# Altium schematic sheet 04.SchDoc
size 420 x 297 mm
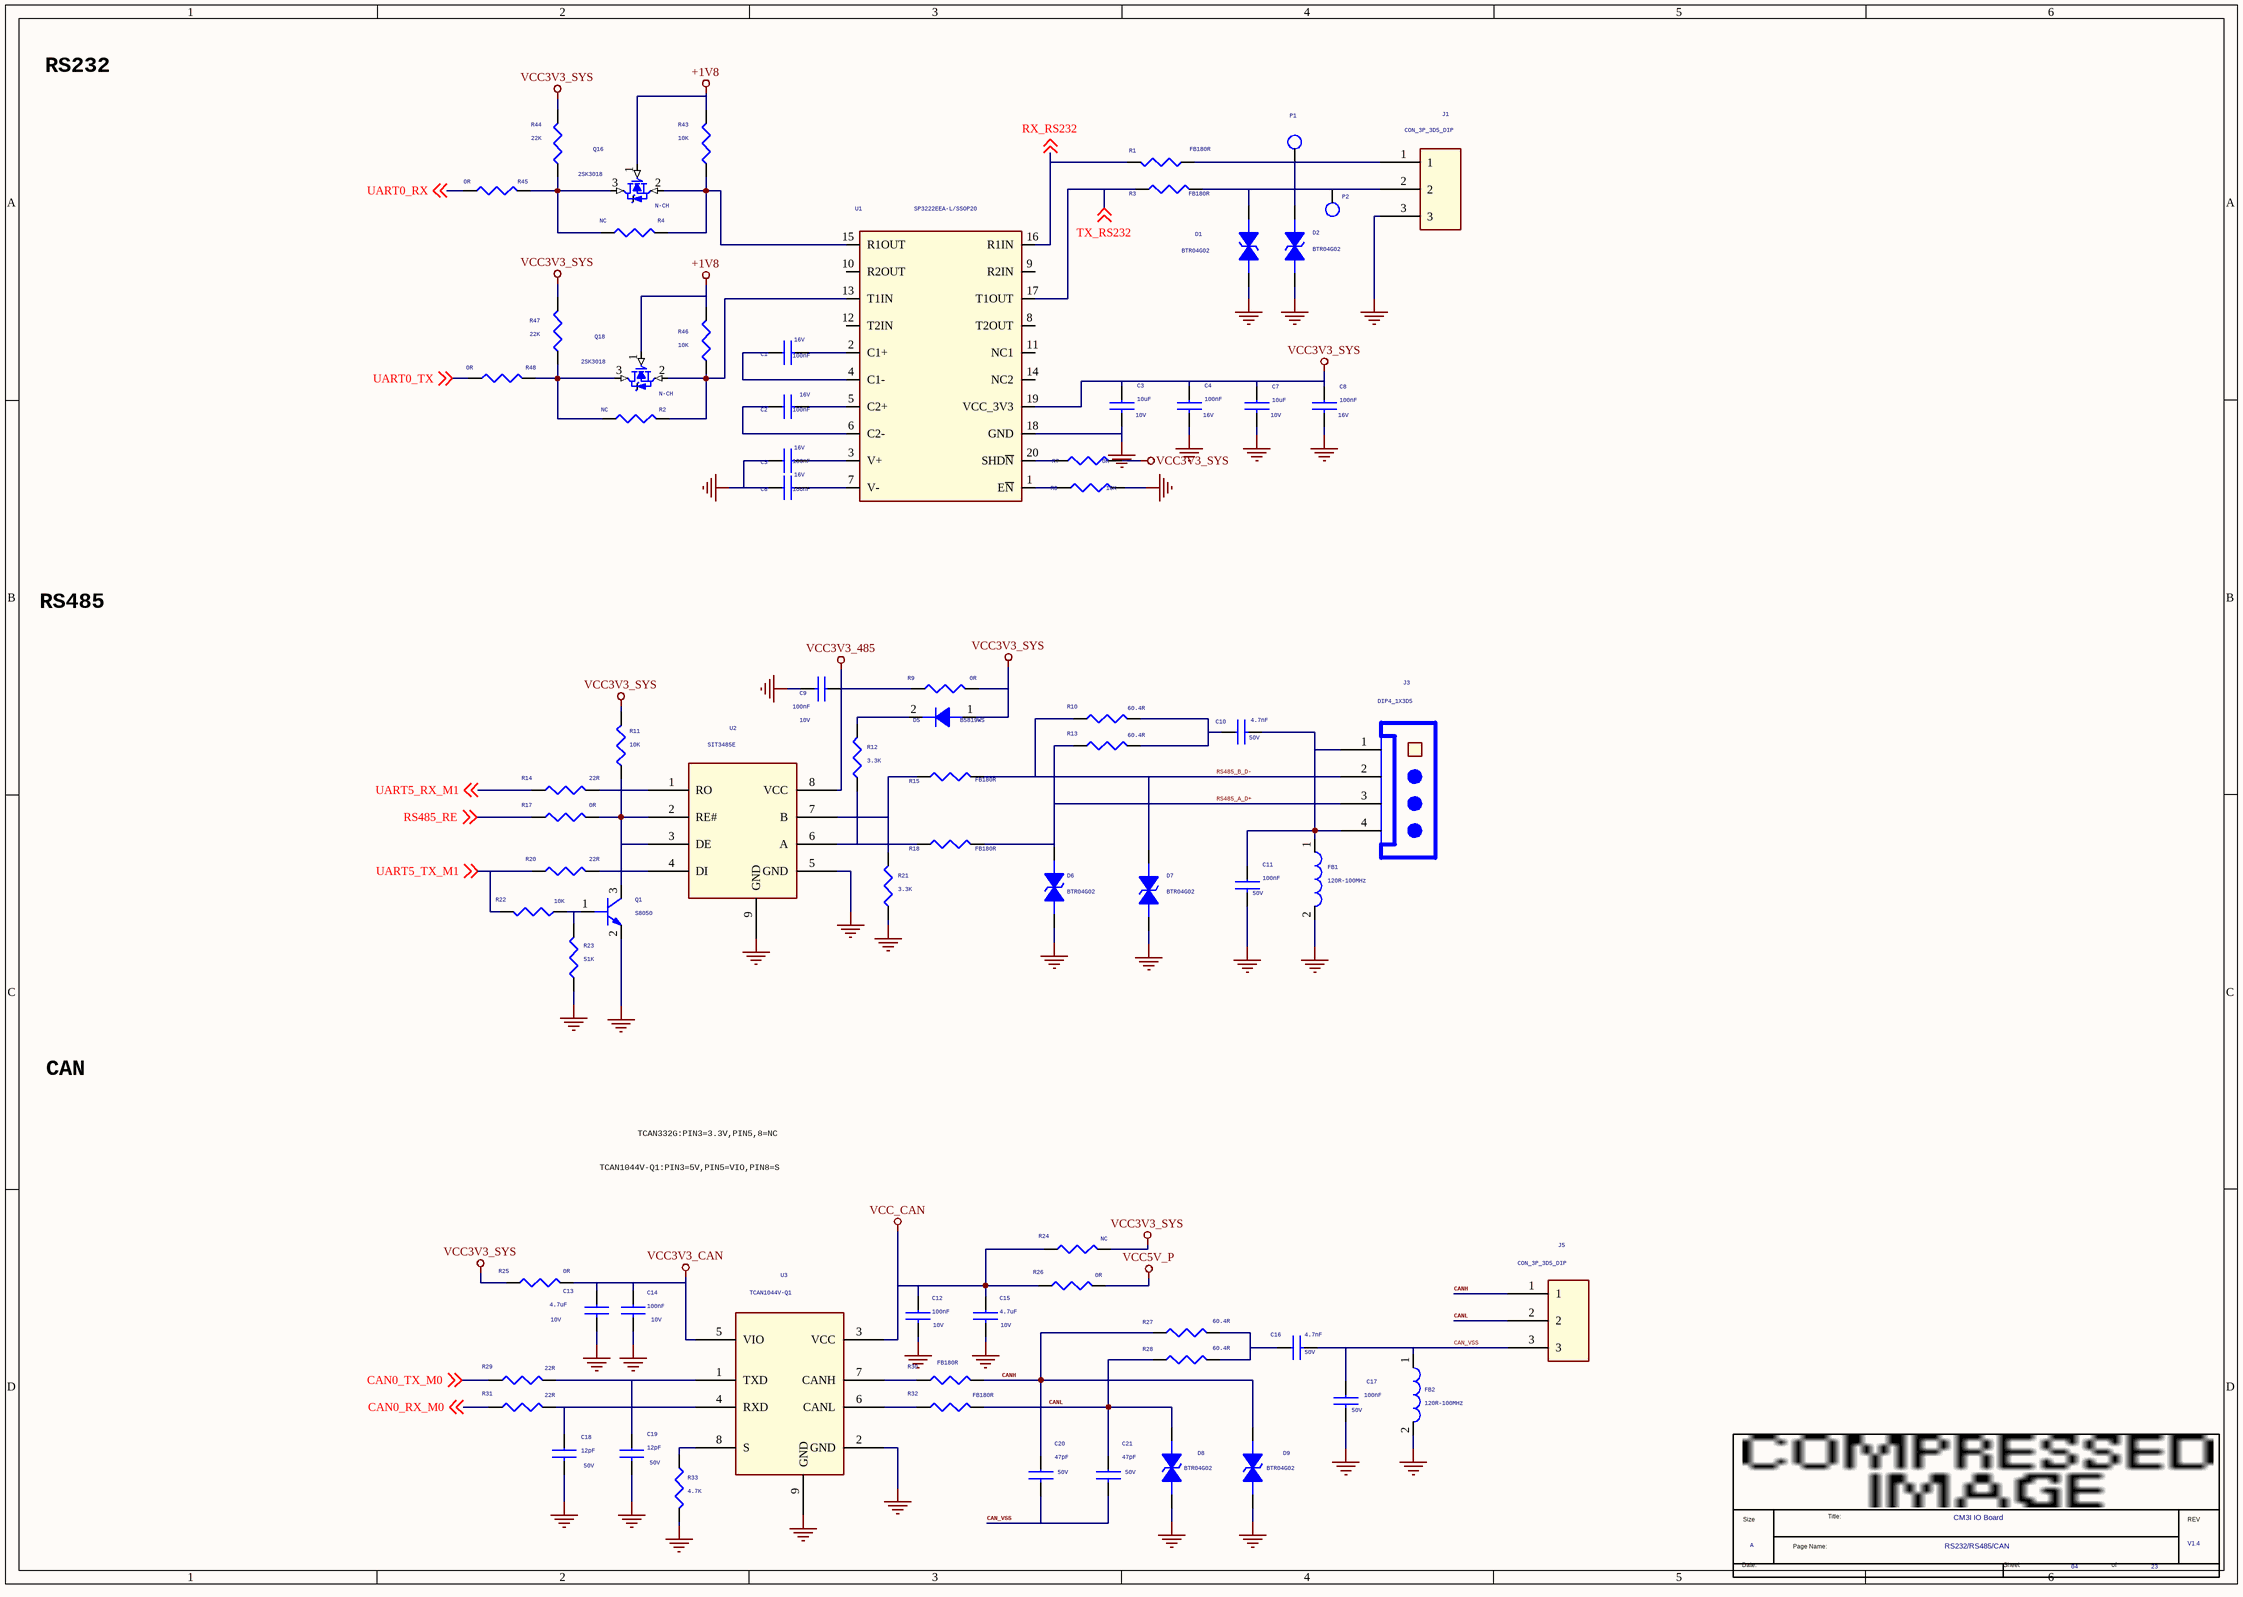
[diagram p0: 04.SchDoc]

## Parts
*  Page Count: 23  Page Number: 04  Page Size: A  Title: CM3I IO Board  RevCode: V1.4  Doc: RS232/RS485/CAN  (hidden comment: radxa_1010)  (graphical)
C1  100nF  Voltage: 16V  [C0402]
C2  100nF  Voltage: 16V  [C0402]
C3  10uF  Voltage: 10V  [C0603]
C4  100nF  Voltage: 16V  [C0402]
C5  100nF  Voltage: 16V  [C0402]
C6  100nF  Voltage: 16V  [C0402]
C7  10uF  Voltage: 10V  [C0603]
C8  100nF  Voltage: 16V  [C0402]
C9  100nF  Voltage: 10V  [C0402]
C10  4.7nF  Voltage: 50V  [C0402]
C11  100nF  Voltage: 50V  [C0603]
C12  100nF  Voltage: 10V  [C0402]
C13  4.7uF  Voltage: 10V  [C0603]
C14  100nF  Voltage: 10V  [C0402]
C15  4.7uF  Voltage: 10V  [C0603]
C16  4.7nF  Voltage: 50V  [C0402]
C17  100nF  Voltage: 50V  [C0603]
C18  12pF  Voltage: 50V  [C0402]
C19  12pF  Voltage: 50V  [C0402]
C20  47pF  Voltage: 50V  [C0402]
C21  47pF  Voltage: 50V  [C0402]
D1  BTR04G02  [ESD0402_1xD5]
D2  BTR04G02  [ESD0402_1xD5]
D5  B5819WS  [SOD_323]
D6  BTR04G02  [ESD0402_1xD5]
D7  BTR04G02  [ESD0402_1xD5]
D8  BTR04G02  [ESD0402_1xD5]
D9  BTR04G02  [ESD0402_1xD5]
FB1  120R-100MHz  [L0603]
FB2  120R-100MHz  [L0603]
J1  CON_3P_3D5_DIP  [DIP3_1X3_2R54]
J3  DIP4_1X3D5  [DIP4_1X3D5]
J5  CON_3P_3D5_DIP  [DIP3_1X3_2R54]
P1  TEST  [TEST]  (value not drawn)
P2  TEST  [TEST]  (value not drawn)
Q1  S8050  [SOT_23]
Q16  2SK3018  [S0T-23]
Q18  2SK3018  [S0T-23]
R1  FB180R  [R0402]
R2  NC  [R0402]
R3  FB180R  [R0402]
R4  NC  [R0402]
R7  0R  [R0402]
R8  10K  [R0402]
R9  0R  [R0402]
R10  60.4R  [R0402]
R11  10K  [R0402]
R12  3.3K  [R0402]
R13  60.4R  [R0402]
R14  22R  [R0402]
R15  FB180R  [R0402]
R17  0R  [R0402]
R18  FB180R  [R0402]
R20  22R  [R0402]
R21  3.3K  [R0402]
R22  10K  [R0402]
R23  51K  [R0402]
R24  NC  [R0402]
R25  0R  [R0402]
R26  0R  [R0402]
R27  60.4R  [R0402]
R28  60.4R  [R0402]
R29  22R  [R0402]
R30  FB180R  [R0402]
R31  22R  [R0402]
R32  FB180R  [R0402]
R33  4.7K  [R0402]
R43  10K  [R0402]
R44  22K  [R0402]
R45  0R  [R0402]
R46  10K  [R0402]
R47  22K  [R0402]
R48  0R  [R0402]
U1  SP3222EEA-L/SSOP20  [SSOP20_1]
U2  SIT3485E  [SOP8_5R00X4R00X1R75_T]
U3  TCAN1044V-Q1  [SOP8_5R00X4R00X1R75_T]

## Nets
+1V8: Q16.1(G) Q18.1(G) R43.1 R46.1
GND: C3.2 C4.2 C5.1 C6.1 C7.2 C8.2 C9.2 C11.2 C12.2 C13.2 C14.2 C15.2 C17.2 C18.2 C19.2 D1.1 D2.1 D6.1 D7.1 D8.1 D9.1 FB1.2 FB2.2 J1.3 Q1.2(EMITTER) R8.2 R21.2 R23.2 R33.2 U1.18(GND) U2.5(GND) U2.9(GND) U3.2(GND) U3.9(GND)
VCC3V3_485: C9.1 R9.1 U2.8(VCC)
VCC3V3_CAN: C13.1 C14.1 R25.2 U3.5(VIO)
VCC3V3_SYS: C3.1 C4.1 C7.1 C8.1 D5.1(A) R7.1 R9.2 R11.1 R24.2 R25.1 R44.1 R47.1 U1.19(VCC_3V3)
VCC5V_P: R26.2
VCC_CAN: C12.1 C15.1 R24.1 R26.1 U3.3(VCC)
CAN0_RX_M0: R31.1 ; off-sheet CAN0_RX_M0
CAN0_TX_M0: R29.1 ; off-sheet CAN0_TX_M0
CAN_VSS: C16.2 C17.1 C20.2 C21.2 FB2.1 J5.3
CANH: C20.1 D9.2 J5.1 R27.1 R30.2
CANL: C21.1 D8.2 J5.2 R28.1 R32.2
RS485_A_D+: D6.2 J3.3(TX) R13.1 R18.2
RS485_B_D-: D7.2 J3.2(RX) R10.1 R15.2
RS485_RE: R17.1 ; off-sheet RS485_RE
RX_RS232: R1.2 U1.16(R1IN) ; off-sheet RX_RS232
TX_RS232: R3.2 U1.17(T1OUT) ; off-sheet TX_RS232
UART0_RX: R45.2 ; off-sheet UART0_RX
UART0_TX: R48.2 ; off-sheet UART0_TX
UART5_RX_M1: R14.1 ; off-sheet UART5_RX_M1
UART5_TX_M1: R20.1 R22.1 ; off-sheet UART5_TX_M1
NetC1_1: C1.1 U1.4(C1-)
NetC1_2: C1.2 U1.2(C1+)
NetC2_1: C2.1 U1.6(C2-)
NetC2_2: C2.2 U1.5(C2+)
NetC5_2: C5.2 U1.3(V+)
NetC6_2: C6.2 U1.7(V-)
NetC10_1: C10.1 R10.2 R13.2
NetC10_2: C10.2 C11.1 FB1.1 J3.1(GND) J3.4(3V3)
NetC16_1: C16.1 R27.2 R28.2
NetC18_1: C18.1 R31.2 U3.4(RXD)
NetC19_1: C19.1 R29.2 U3.1(TXD)
NetD1_2: D1.2 J1.2 P2.1 R3.1
NetD2_2: D2.2 J1.1 P1.1 R1.1
NetD5_2: D5.2(K) R12.1
NetQ1_1: Q1.1(BASE) R22.2 R23.1
NetQ1_3: Q1.3(COLLECTOR) R11.2 R17.2 U2.2(RE#) U2.3(DE)
NetQ16_2: Q16.2(S) R4.1 R43.2 U1.15(R1OUT)
NetQ16_3: Q16.3(D) R4.2 R44.2 R45.1
NetQ18_2: Q18.2(S) R2.1 R46.2 U1.13(T1IN)
NetQ18_3: Q18.3(D) R2.2 R47.2 R48.1
NetR7_2: R7.2 U1.20(SHD~{N})
NetR8_1: R8.1 U1.1(E~{N})
NetR12_2: R12.2 R18.1 U2.6(A)
NetR14_2: R14.2 U2.1(RO)
NetR15_1: R15.1 R21.1 U2.7(B)
NetR20_2: R20.2 U2.4(DI)
NetR30_1: R30.1 U3.7(CANH)
NetR32_1: R32.1 U3.6(CANL)
NetR33_1: R33.1 U3.8(S)

Not connected (* = marked no-connect by the designer): U1 8(T2OUT) 9(R2IN) 10(R2OUT) 11(NC1) 12(T2IN) 14(NC2)

## Notes on the sheet
- RS232
- RS485
- CAN
- TCAN332G:PIN3=3.3V,PIN5,8=NC
- TCAN1044V-Q1:PIN3=5V,PIN5=VIO,PIN8=S
- (in symbol N-MOSFET) N-CH
- (in symbol radxa_1010) Size; Title:; REV; Page Name:; Date:; Sheet; of

## Library data of the parts
C1 C2 = CAP NP_0: cap,100.00nF,+/-10%,16V,X5R,C0402; Manufacturer: TDK; RK PN: C1005X5R1C104K050BA; Priority: A; Tolerance: 10%; Dielectric: X5R; Part Type: C0402; Manufacturer PN: C1005X5R1C104K050BA; Created by: JJJ
C3 C15 = CAP NP_0: cap,4.70uF,+/-10%,10V,X5R,C0603; Manufacturer: TDK; RK PN: C1608X5R1A475K080AC; Priority: A; Tolerance: 10%; Dielectric: X5R; Part Type: C0603; Manufacturer PN: C1608X5R1A475K080AC; Created by: JJJ
C4-C6 C8 = CAP NP_0: cap,100.00nF,+/-10%,16V,X5R,C0402; Manufacturer PN: C1005X5R1C104K050BA; Manufacturer: TDK; Tolerance: 10%; Priority: A; Dielectric: X5R; Created by: JJJ; Part Type: C0402; RK PN: C1005X5R1C104K050BA
C7 = CAP NP_0: cap,4.70uF,+/-10%,10V,X5R,C0603; Manufacturer PN: C1608X5R1A475K080AC; Manufacturer: TDK; Tolerance: 10%; Priority: A; Dielectric: X5R; Created by: JJJ; Part Type: C0603; RK PN: C1608X5R1A475K080AC
C9 = CAP NP_0: cap,100.00nF,+/-10%,10V,X5R,C0402; Manufacturer: TDK; Number: 37; RK PN: C1005X5R1A104K050BA; Priority: A; Tolerance: 10%; C_Voltage: 6.3V; Dielectric: X5R; Part Type: C0402; Manufacturer PN: C1005X5R1A104K050BA; Created by: JJJ
C10 C16 = CAP NP_0: cap,4.70nF,+/-10%,50V,X5R,C0402; Manufacturer PN: C1005X5R1H472K050BA; Manufacturer: TDK; Tolerance: 10%; Priority: A; Dielectric: X5R; Created by: JJJ; C_Voltage: 50V; Part Type: C0402; RK PN: C1005X5R1H472K050BA
C11 = CAP NP_0: cap,100.00nF,+/-10%,50V,X5R,C0603; Manufacturer: TDK; RK PN: C1608X5R1H104K080AA; Priority: A; C_Voltage: 6.3V; Tolerance: 10%; Dielectric: X5R; Part Type: C0603; Manufacturer PN: C1608X5R1H104K080AA; Created by: JJJ
C12 C14 = CAP NP_0: cap,100.00nF,+/-10%,10V,X5R,C0402; Manufacturer PN: C1005X5R1A104K050BA; Manufacturer: TDK; Tolerance: 10%; Priority: A; Dielectric: X5R; Created by: JJJ; Part Type: C0402; RK PN: C1005X5R1A104K050BA
C13 = CAP NP_0: cap,4.70uF,+/-10%,10V,X5R,C0603; Manufacturer: TDK; RK PN: C1608X5R1A475K080AC; Tolerance: 10%; Priority: A; Dielectric: X5R; Created by: JJJ; Part Type: C0603; Manufacturer PN: C1608X5R1A475K080AC
C17 = CAP NP_0: cap,100.00nF,+/-10%,50V,X5R,C0603; Manufacturer PN: C1608X5R1H104K080AA; Manufacturer: TDK; Tolerance: 10%; C_Voltage: 6.3V; Priority: A; Dielectric: X5R; Created by: JJJ; Part Type: C0603; RK PN: C1608X5R1H104K080AA
C18 C19 = CAP NP_0: cap,12.00pF,+/-5%,50V,C0G,C0402; Manufacturer PN: C1005C0G1H120J050BA; Manufacturer: TDK; Tolerance: 5%; Priority: A; OPTION: DNP; Dielectric: C0G; Created by: JJJ; C_Voltage: 50V; Part Type: C0402; RK PN: C1005C0G1H120J050BA
C20 C21 = CAP NP_0: cap,47.00pF,+/-5%,50V,C0G,C0402; Manufacturer: TDK; RK PN: C1005C0G1H470J050BA; Priority: A; Tolerance: 5%; OPTION: DNP; Dielectric: C0G; Part Type: C0402; C_Voltage: 50V; Manufacturer PN: C1005C0G1H470J050BA; Created by: JJJ
D1 D2 D8 D9 = DIODE BI_DIR TRIG_0: 1-Line, Bi-directional, Transient Voltage Suppressors.17.5pF.; Manufacturer: WillSemi(韦尔半导体); RK PN: ESD5451N; Priority: A; OPTION: DNP; Part Type: ESD_TVS; Manufacturer PN: ESD5451N; Created by: JJJ
D5 = DIODE_Dup2: Schottky Barrier，B5819WS SOD-323; Manufacturer: 长电; Priority: A; RK PN: B5819WS; Part Type: Schottky rectifier; Manufacturer PN: B5819WS; Created by: JJJ
D6 D7 = DIODE BI_DIR TRIG_0: 1-Line, Bi-directional, Transient Voltage Suppressors.17.5pF.; Manufacturer PN: ESD5451N; Manufacturer: WillSemi(韦尔半导体); OPTION: DNP; Priority: A; Created by: JJJ; Part Type: ESD_TVS; RK PN: ESD5451N
FB1 FB2 = BEAD: BEAD,120R@100MHz,current=2000mA,0603; Manufacturer PN: BLM18KG121TN1; Manufacturer: Murata; DC Resistor: 0.030ohm; Tolerance: 25%; Irms: 2A; Priority: L; Created by: DZS; Part Type: BEAD; RK PN: BLM18KG121TN1
J1 J5 = CON3_1X3: 单排3PIN（间距2.54mm）不带防护墙的插针; RK PN: CON3M_1X3_2R54_V; Priority: A; Part Type: Header; Manufacturer Part Number: CON3M_1X3_2R54_V; Created by: JJJ
J3 = CON4_0
P1 P2 = TESTPOINT1
Q1 = NPN: S8050,SOT23; Manufacturer: 长电; Manufacturer PN: S8050_SOT23; OPTION: DNP; Priority: A; Ic: 0.5A; Vceo: 25V; Pc: 0.3W; RK PN: S8050; Part Type: NPN; Created by: JJJ
Q16 Q18 = N-MOSFET: SANZ_P/N: SK2300; Part Type: MOS管
R1 R14 = RESISTOR_0_Dup1: 通用厚膜电阻,22R,+/-5%,R0402,1/16W.; Manufacturer PN: RC0402JR-0722RL; Manufacturer: YAGEO; Tolerance: 5%; Wattage: 1/16W; Priority: A; Created by: YTL; Part Type: 通用厚膜电阻; RK PN: RC0402JR-0722RL
R2 R4 = RESISTOR_2: 通用厚膜电阻,22R,+/-5%,R0402,1/16W.; Manufacturer: YAGEO; Tolerance: 5%; RK PN: RC0402JR-0722RL; Priority: A; Wattage: 1/16W; Part Type: 通用厚膜电阻; Manufacturer PN: RC0402JR-0722RL; Created by: YTL
R3 R7 R20 R29 R31 = RESISTOR_0_Dup1: 通用厚膜电阻,22R,+/-5%,R0402,1/16W.; Manufacturer: YAGEO; Tolerance: 5%; RK PN: RC0402JR-0722RL; Priority: A; Wattage: 1/16W; Part Type: 通用厚膜电阻; Manufacturer PN: RC0402JR-0722RL; Created by: YTL
R8 = RESISTOR_0_Dup1: 通用厚膜电阻,10K,+/-5%,R0402,1/16W.; Manufacturer PN: RC0402JR-0710KL; Manufacturer: YAGEO; Tolerance: 5%; Wattage: 1/16W; Priority: A; Created by: YTL; Part Type: 通用厚膜电阻; RK PN: RC0402JR-0710KL
R9 R26 = RESISTOR_0_Dup1: 通用厚膜电阻,0R,+/-5%,R0402,1/16W.; Manufacturer PN: RC0402JR-070RL; Manufacturer: YAGEO; Tolerance: 5%; Wattage: 1/16W; Priority: A; Created by: YTL; Part Type: 通用厚膜电阻; RK PN: RC0402JR-070RL
R10 R28 = RESISTOR_0_Dup1: 通用厚膜电阻,60R4,+/-1%,R1206,1/4W.; Manufacturer: YAGEO; Tolerance: 1%; RK PN: RC1206FR-0760R4L; Priority: A; Wattage: 1/4W; Part Type: 通用厚膜电阻; Manufacturer PN: RC1206FR-0760R4L; Created by: YTL
R11 = RESISTOR_0_Dup1: 通用厚膜电阻,10K,+/-5%,R0402,1/16W.; Manufacturer PN: RC0402JR-0710KL; Manufacturer: YAGEO; Tolerance: 5%; Wattage: 1/16W; Priority: A; OPTION: DNP; Created by: YTL; Part Type: 通用厚膜电阻; RK PN: RC0402JR-0710KL
R12 = RESISTOR_0_Dup1: 通用厚膜电阻,3K3,+/-5%,R0402,1/16W.; Manufacturer: YAGEO; Tolerance: 5%; RK PN: RC0402JR-073K3L; Priority: A; Wattage: 1/16W; Part Type: 通用厚膜电阻; Manufacturer PN: RC0402JR-073K3L; Created by: YTL
R13 R27 = RESISTOR_0_Dup1: 通用厚膜电阻,60R4,+/-1%,R1206,1/4W.; Manufacturer PN: RC1206FR-0760R4L; Manufacturer: YAGEO; Tolerance: 1%; Wattage: 1/4W; Priority: A; Created by: YTL; Part Type: 通用厚膜电阻; RK PN: RC1206FR-0760R4L
R15 R18 = RESISTOR_0_Dup1: 通用厚膜电阻,0R,+/-5%,R0805,1/8W.; Manufacturer: YAGEO; Tolerance: 5%; RK PN: RC0805JR-070RL; Priority: A; Wattage: 1/8W; Part Type: 通用厚膜电阻; Manufacturer PN: RC0805JR-070RL; Created by: YTL
R17 R25 = RESISTOR_0_Dup1: 通用厚膜电阻,0R,+/-5%,R0402,1/16W.; Manufacturer: YAGEO; Tolerance: 5%; RK PN: RC0402JR-070RL; Priority: A; Wattage: 1/16W; Part Type: 通用厚膜电阻; Manufacturer PN: RC0402JR-070RL; Created by: YTL
R21 = RESISTOR_0_Dup1: 通用厚膜电阻,3K3,+/-5%,R0402,1/16W.; Manufacturer PN: RC0402JR-073K3L; Manufacturer: YAGEO; Tolerance: 5%; Wattage: 1/16W; Priority: A; Created by: YTL; Part Type: 通用厚膜电阻; RK PN: RC0402JR-073K3L
R22 = RESISTOR_0_Dup1: 通用厚膜电阻,10K,+/-5%,R0402,1/16W.; Manufacturer: YAGEO; Tolerance: 5%; OPTION: DNP; RK PN: RC0402JR-0710KL; Priority: A; Wattage: 1/16W; Part Type: 通用厚膜电阻; Manufacturer PN: RC0402JR-0710KL; Created by: YTL
R23 = RESISTOR_0_Dup1: 通用厚膜电阻,51K,+/-5%,R0402,1/16W.; Manufacturer PN: RC0402JR-0751KL; Manufacturer: YAGEO; Tolerance: 5%; OPTION: DNP; Wattage: 1/16W; Priority: A; Created by: YTL; Part Type: 通用厚膜电阻; RK PN: RC0402JR-0751KL
R24 = RESISTOR_0_Dup1: 通用厚膜电阻,0R,+/-5%,R0402,1/16W.; Manufacturer PN: RC0402JR-070RL; Manufacturer: YAGEO; Tolerance: 5%; OPTION: DNP; Wattage: 1/16W; Priority: A; Created by: YTL; Part Type: 通用厚膜电阻; RK PN: RC0402JR-070RL
R30 R32 = RESISTOR_0_Dup1: 通用厚膜电阻,0R,+/-5%,R0805,1/8W.; Manufacturer PN: RC0805JR-070RL; Manufacturer: YAGEO; Tolerance: 5%; Wattage: 1/8W; Priority: A; Created by: YTL; Part Type: 通用厚膜电阻; RK PN: RC0805JR-070RL
R33 = RESISTOR_0_Dup1: 通用厚膜电阻,4K7,+/-5%,R0402,1/16W.; Manufacturer: YAGEO; Tolerance: 5%; RK PN: RC0402JR-074K7L; Priority: A; Wattage: 1/16W; Part Type: 通用厚膜电阻; Manufacturer PN: RC0402JR-074K7L; Created by: YTL
R43 = RESISTOR_0: 通用厚膜电阻,10K,+/-5%,R0402,1/16W.; Manufacturer: YAGEO; Tolerance: 5%; RK PN: RC0402JR-0710KL; Priority: A; Wattage: 1/16W; Part Type: 通用厚膜电阻; Manufacturer PN: RC0402JR-0710KL; Created by: YTL
R44 = RESISTOR_0: 通用厚膜电阻,1K5,+/-5%,R0402,1/16W.; Manufacturer PN: RC0402JR-071K5L; Manufacturer: YAGEO; Tolerance: 5%; Wattage: 1/16W; Priority: A; Created by: YTL; Part Type: 通用厚膜电阻; RK PN: RC0402JR-071K5L
R45 R48 = RESISTOR_2: 通用厚膜电阻,22R,+/-5%,R0402,1/16W.; Manufacturer PN: RC0402JR-0722RL; Manufacturer: YAGEO; Tolerance: 5%; Wattage: 1/16W; Priority: A; Created by: YTL; Part Type: 通用厚膜电阻; RK PN: RC0402JR-0722RL
R46 = RESISTOR_0: 通用厚膜电阻,10K,+/-5%,R0402,1/16W.; Manufacturer PN: RC0402JR-0710KL; Manufacturer: YAGEO; Tolerance: 5%; Wattage: 1/16W; Priority: A; Created by: YTL; Part Type: 通用厚膜电阻; RK PN: RC0402JR-0710KL
R47 = RESISTOR_0: 通用厚膜电阻,1K5,+/-5%,R0402,1/16W.; Manufacturer: YAGEO; Tolerance: 5%; RK PN: RC0402JR-071K5L; Priority: A; Wattage: 1/16W; Part Type: 通用厚膜电阻; Manufacturer PN: RC0402JR-071K5L; Created by: YTL
U1 = XR21V1410_0
U2 = MAX3485_0
U3 = TJA1051T_0
* = radxa_1010: Page Create Date: March  8, 1995